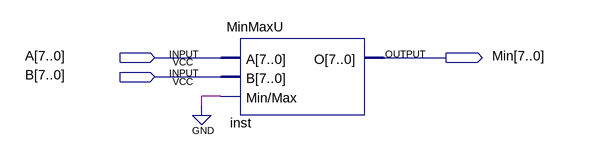
[diagram p0: schematic sheet]
// Quartus schematic MinUnit.bdf as structural Verilog: 1 symbols, 3 pins
module MinUnit (
  input  [7:0] A,
  input  [7:0] B,
  output [7:0] Min
);

  MinMaxU inst (.A(A), .B(B), .\Min/Max (1'b0), .O(Min));
endmodule
